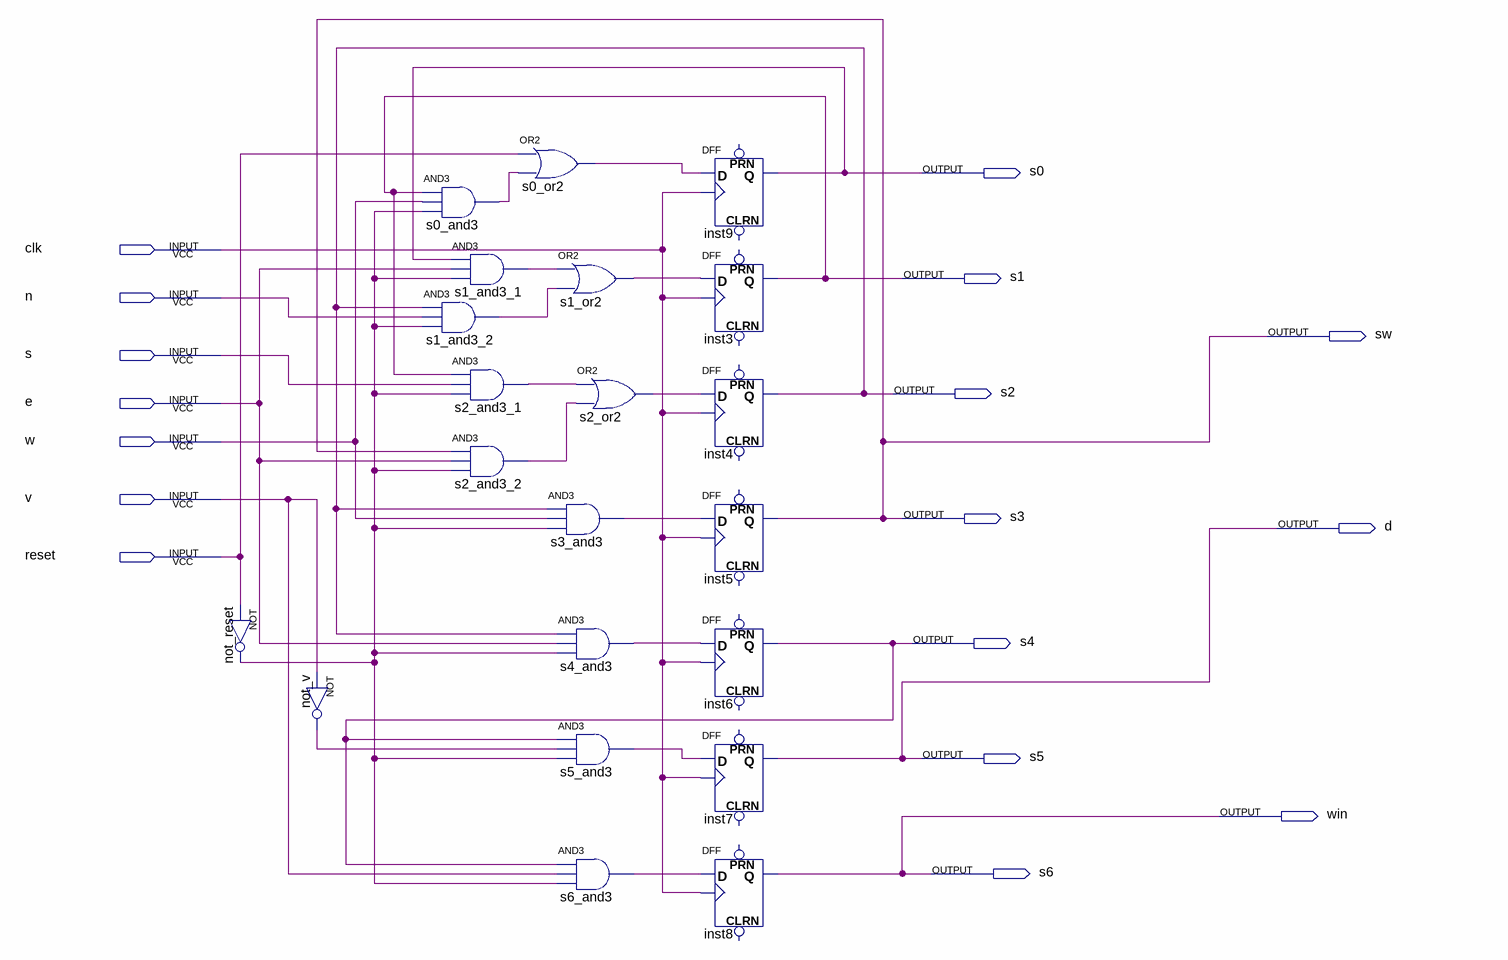
[diagram p0: schematic sheet]
// Quartus schematic room.bdf as structural Verilog: 21 symbols, 17 pins
module room (
  input  clk,
  input  n,
  input  s,
  input  e,
  input  w,
  input  v,
  input  reset,
  output s0,
  output s1,
  output sw,
  output s2,
  output s3,
  output d,
  output s4,
  output s5,
  output win,
  output s6
);

  wire not_reset_out, not_v_out, s0_and3_out, s0_or2_out, s1_and3_1_out, s1_and3_2_out, s1_or2_out,
       s2_and3_1_out, s2_and3_2_out, s2_or2_out, s3_and3_out, s4_and3_out, s5_and3_out, s6_and3_out;

  not not_reset (not_reset_out, reset);
  not not_v (not_v_out, v);
  and s0_and3 (s0_and3_out, s1, w, not_reset_out);
  and s1_and3_1 (s1_and3_1_out, s0, e, not_reset_out);
  and s1_and3_2 (s1_and3_2_out, s2, n, not_reset_out);
  and s2_and3_1 (s2_and3_1_out, s1, s, not_reset_out);
  and s2_and3_2 (s2_and3_2_out, s3, e, not_reset_out);
  or s0_or2 (s0_or2_out, reset, s0_and3_out);
  or s1_or2 (s1_or2_out, s1_and3_1_out, s1_and3_2_out);
  and s3_and3 (s3_and3_out, s2, w, not_reset_out);
  and s4_and3 (s4_and3_out, s2, e, not_reset_out);
  and s5_and3 (s5_and3_out, s4, not_v_out, not_reset_out);
  and s6_and3 (s6_and3_out, s4, v, not_reset_out);
  or s2_or2 (s2_or2_out, s2_and3_1_out, s2_and3_2_out);
  DFF inst9 (.CLK(clk), .D(s0_or2_out), .Q(s0));  // open: CLRN, PRN
  DFF inst3 (.CLK(clk), .D(s1_or2_out), .Q(s1));  // open: CLRN, PRN
  DFF inst4 (.CLK(clk), .D(s2_or2_out), .Q(s2));  // open: CLRN, PRN
  DFF inst5 (.CLK(clk), .D(s3_and3_out), .Q(s3));  // open: CLRN, PRN
  DFF inst6 (.CLK(clk), .D(s4_and3_out), .Q(s4));  // open: CLRN, PRN
  DFF inst7 (.CLK(clk), .D(s5_and3_out), .Q(d));  // open: CLRN, PRN
  DFF inst8 (.CLK(clk), .D(s6_and3_out), .Q(s6));  // open: CLRN, PRN

  assign s5 = d;
  assign sw = s3;
  assign win = s6;
endmodule
